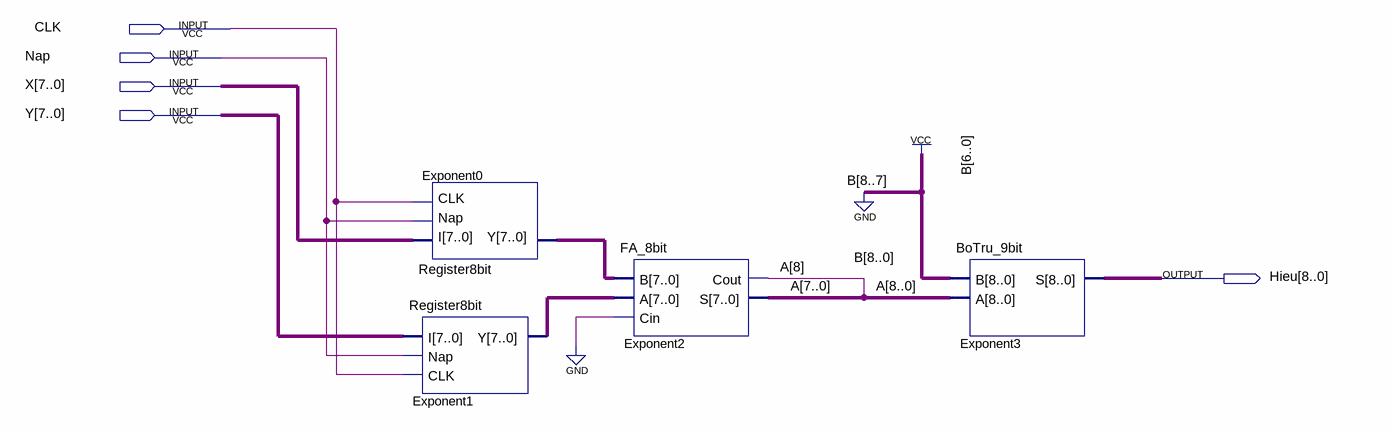
[diagram p0: schematic sheet]
// Quartus schematic Exponent.bdf as structural Verilog: 4 symbols, 5 pins
module Exponent (
  input  CLK,
  input  Nap,
  input  [7:0] X,
  input  [7:0] Y,
  output [8:0] Hieu
);

  wire [7:0] Exponent0_y, Exponent1_y;
  wire [8:0] A;

  Register8bit Exponent0 (.I(X), .Nap(Nap), .CLK(CLK), .Y(Exponent0_y));
  Register8bit Exponent1 (.I(Y), .Nap(Nap), .CLK(CLK), .Y(Exponent1_y));
  FA_8bit Exponent2 (.B(Exponent0_y), .A(Exponent1_y), .Cin(1'b0), .Cout(A[8]), .S(A[7:0]));
  BoTru_9bit Exponent3 (.B(9'b001111111), .A(A), .S(Hieu));
endmodule
